# Altium schematic sheet haptic_ring.SchDoc
size A4
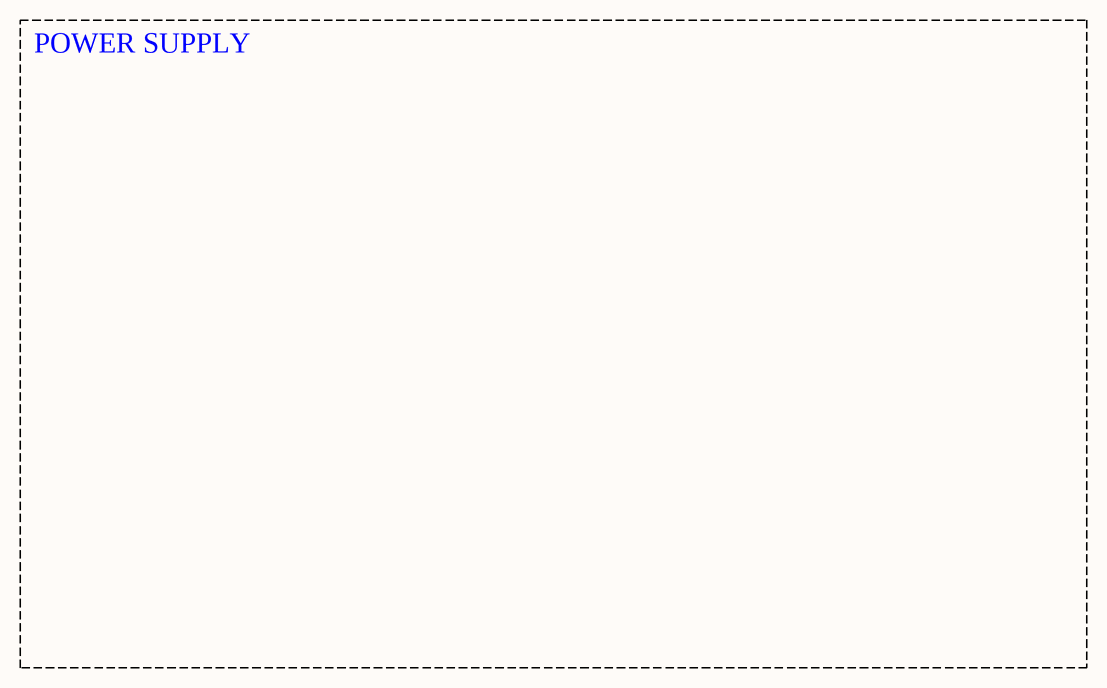
[diagram p0: haptic_ring.SchDoc]

## Notes on the sheet
- POWER SUPPLY